# EAGLE schematic ALUDecoderMore1v2 (EAGLE 6.5.0)
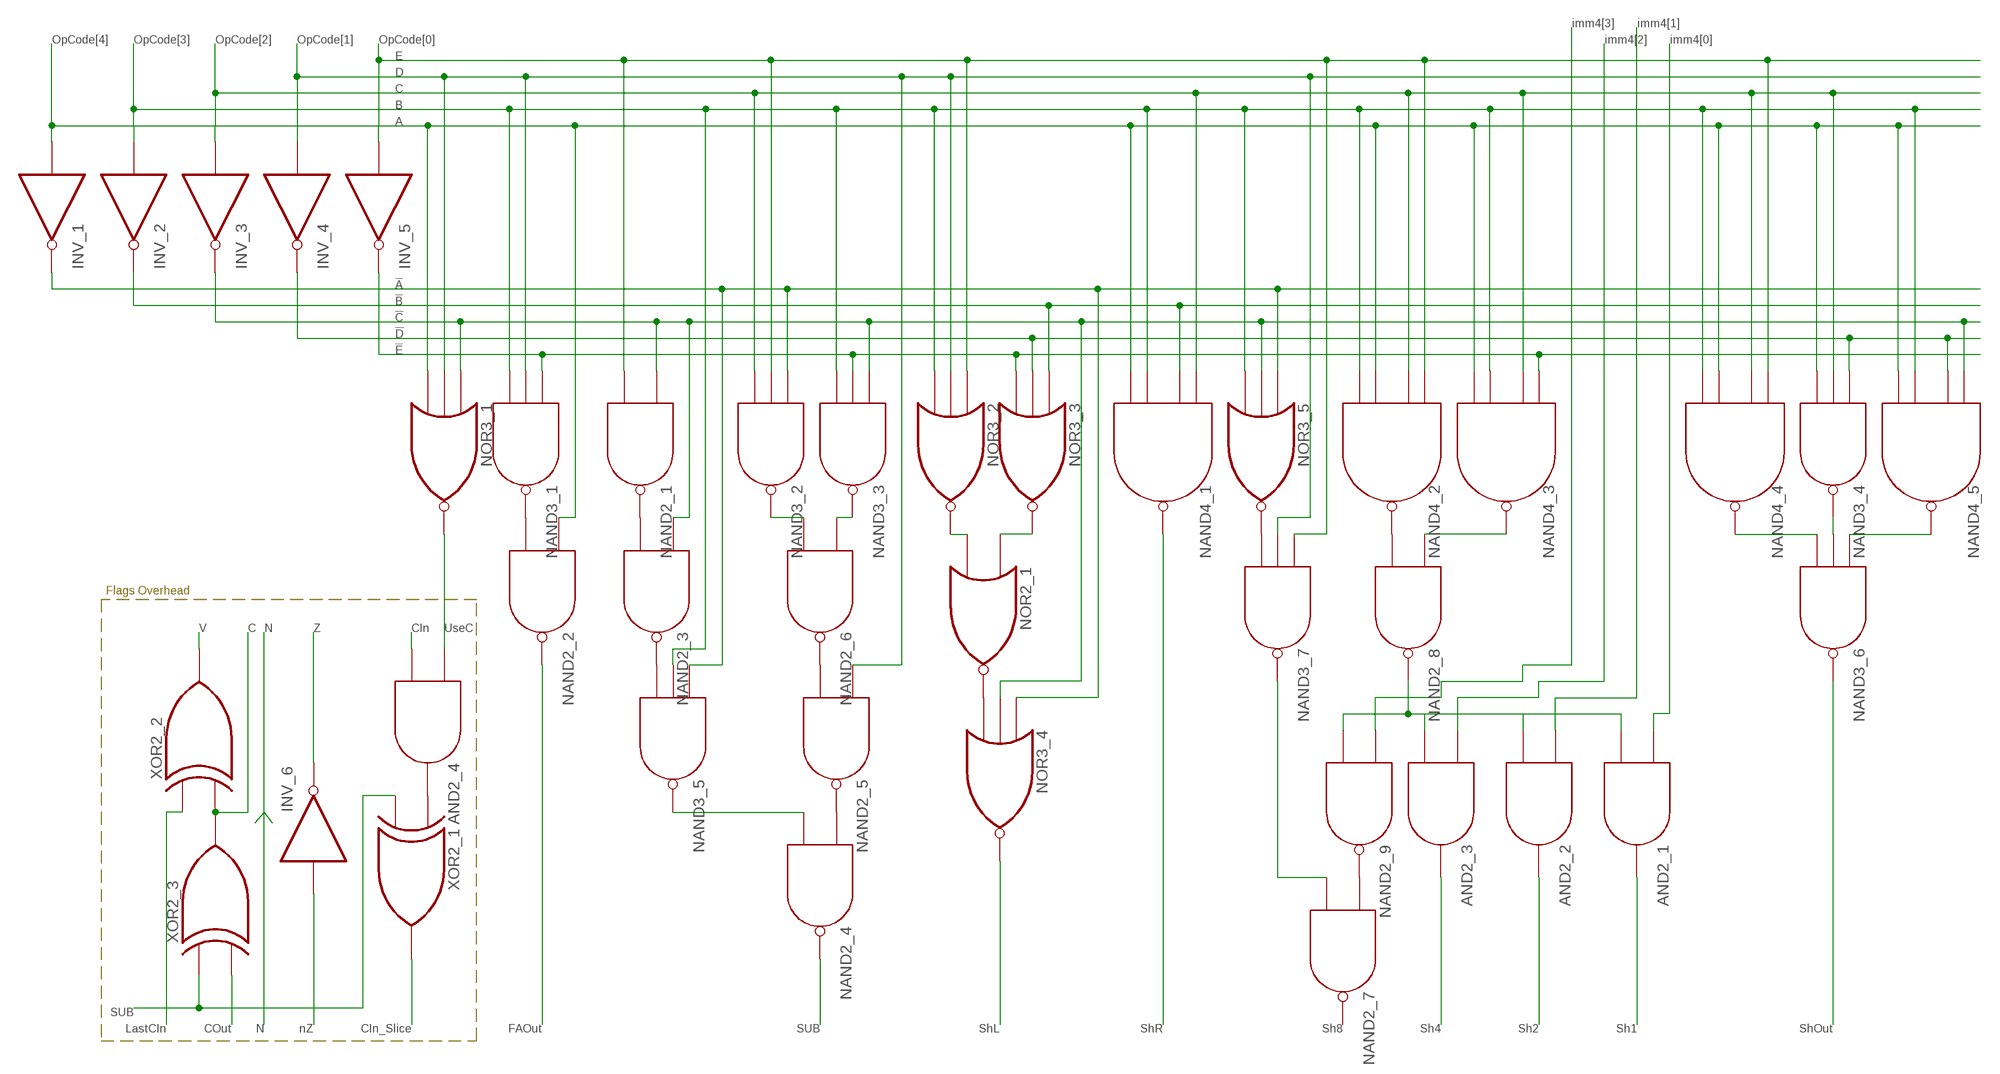
[diagram p0: schematic, sheet 1]

## Parts
AND2_1  AND2  [3PIN]
AND2_2  AND2  [3PIN]
AND2_3  AND2  [3PIN]
AND2_4  AND2  [3PIN]
INV_1  INV  [3PIN]
INV_2  INV  [3PIN]
INV_3  INV  [3PIN]
INV_4  INV  [3PIN]
INV_5  INV  [3PIN]
INV_6  INV  [3PIN]
NAND2_1  NAND2  [3PIN]
NAND2_2  NAND2  [3PIN]
NAND2_3  NAND2  [3PIN]
NAND2_4  NAND2  [3PIN]
NAND2_5  NAND2  [3PIN]
NAND2_6  NAND2  [3PIN]
NAND2_7  NAND2  [3PIN]
NAND2_8  NAND2  [3PIN]
NAND2_9  NAND2  [3PIN]
NAND3_1  NAND3  [5PIN]
NAND3_2  NAND3  [5PIN]
NAND3_3  NAND3  [5PIN]
NAND3_4  NAND3  [5PIN]
NAND3_5  NAND3  [5PIN]
NAND3_6  NAND3  [5PIN]
NAND3_7  NAND3  [5PIN]
NAND4_1  NAND4  [5PIN]
NAND4_2  NAND4  [5PIN]
NAND4_3  NAND4  [5PIN]
NAND4_4  NAND4  [5PIN]
NAND4_5  NAND4  [5PIN]
NOR2_1  NOR2  [3PIN]
NOR3_1  NOR3  [5PIN]
NOR3_2  NOR3  [5PIN]
NOR3_3  NOR3  [5PIN]
NOR3_4  NOR3  [5PIN]
NOR3_5  NOR3  [5PIN]
XOR2_1  XOR2  [3PIN]
XOR2_2  XOR2  [3PIN]
XOR2_3  XOR2  [3PIN]

## Nets
N$1: NAND2_1.P$3(O) NAND2_3.P$2(I1)
N$3: NAND2_2.P$2(I1) NAND3_1.P$4(O)
N$4: NAND2_3.P$3(O) NAND3_5.P$2(I1)
N$6: NAND2_6.P$2(I1) NAND3_2.P$4(O)
N$7: NAND2_2.P$3(O)
N$8: NAND2_6.P$1(A) NAND3_3.P$4(O)
N$9: NOR2_1.P$1(I0) NOR3_3.P$4(O)
N$10: NOR2_1.P$2(I1) NOR3_2.P$4(O)
N$11: NOR2_1.P$3(O) NOR3_4.P$2(I1)
N$12: NAND2_8.P$2(I1) NAND4_2.P$5(O)
N$13: NAND2_8.P$1(A) NAND4_3.P$5(O)
N$14: NAND2_4.P$1(A) NAND2_5.P$3(O)
N$15: NAND2_4.P$3(O)
N$16: AND2_1.P$2(I1) AND2_2.P$2(I1) AND2_3.P$2(I1) NAND2_8.P$3(O) NAND2_9.P$2(I1)
N$17: NAND3_6.P$2(I1) NAND4_4.P$5(O)
N$18: NAND3_4.P$4(O) NAND3_6.P$3(I2)
N$19: NOR3_4.P$4(O)
N$20: NAND3_6.P$1(A) NAND4_5.P$5(O)
N$22: NAND3_7.P$2(I1) NOR3_5.P$4(O)
N$23: XOR2_2.P$2(I1) XOR2_3.P$3(O)
N$24: NAND2_9.P$1(A)
N$25: XOR2_2.P$3(O)
N$27: NAND2_7.P$2(I1) NAND3_7.P$4(O)
N$28: AND2_3.P$1(A)
N$29: AND2_2.P$1(A)
N$30: AND2_1.P$1(A)
N$31: AND2_3.P$3(O)
N$32: AND2_2.P$3(O)
N$33: AND2_1.P$3(O)
N$35: INV_6.P$1(I)
N$36: XOR2_3.P$2(I1)
N$37: NAND3_6.P$4(O)
N$39: INV_6.P$2(O)
N$40: AND2_4.P$2(I1)
N$41: AND2_4.P$1(A) NOR3_1.P$4(O)
N$42: AND2_4.P$3(O) XOR2_1.P$1(I0)
N$43: XOR2_1.P$2(I1) XOR2_3.P$1(I0)
N$44: XOR2_1.P$3(O)
N$45: INV_2.P$1(I)
N$46: INV_3.P$1(I)
N$47: INV_4.P$1(I)
N$48: INV_5.P$1(I)
N$49: INV_3.P$2(O) INV_4.P$2(O) INV_5.P$2(O) NAND2_1.P$1(A) NAND2_3.P$1(A) NAND3_1.P$1(A) NAND3_3.P$1(A) NAND3_3.P$3(I2) NAND3_4.P$1(A) NAND4_3.P$1(A) NAND4_5.P$1(A) NAND4_5.P$2(A1) NOR3_1.P$1(I0) NOR3_3.P$2(I1) NOR3_3.P$3(I2) NOR3_4.P$3(I2) NOR3_5.P$3(I2)
N$50: NAND2_4.P$2(I1) NAND3_5.P$4(O)
N$51: NAND2_5.P$2(I1) NAND2_6.P$3(O)
N$52: NAND2_7.P$1(A) NAND2_9.P$3(O)
N$53: INV_1.P$2(O) NAND3_2.P$1(A) NAND3_5.P$1(A) NOR3_4.P$1(I0) NOR3_5.P$1(I0)
N$78: INV_2.P$2(O) NAND4_1.P$2(A1) NOR3_3.P$1(I0)
N$94: INV_1.P$1(I) NAND2_1.P$2(I1) NAND2_2.P$1(A) NAND2_5.P$1(A) NAND3_1.P$2(I1) NAND3_1.P$3(I2) NAND3_2.P$2(I1) NAND3_2.P$3(I2) NAND3_3.P$2(I1) NAND3_4.P$2(I1) NAND3_4.P$3(I2) NAND3_5.P$3(I2) NAND3_7.P$1(A) NAND3_7.P$3(I2) NAND4_1.P$3(I1) NAND4_1.P$4(I2) NAND4_2.P$1(A) NAND4_2.P$2(A1) NAND4_2.P$3(I1) NAND4_2.P$4(I2) NAND4_3.P$2(A1) NAND4_3.P$3(I1) NAND4_3.P$4(I2) NAND4_4.P$1(A) NAND4_4.P$2(A1) NAND4_4.P$3(I1) NAND4_4.P$4(I2) NAND4_5.P$3(I1) NAND4_5.P$4(I2) NOR3_1.P$2(I1) NOR3_1.P$3(I2) NOR3_2.P$1(I0) NOR3_2.P$2(I1) NOR3_2.P$3(I2) NOR3_5.P$2(I1)
Unconnected: NAND2_7.P$3(O) NAND4_1.P$1(A) NAND4_1.P$5(O) XOR2_2.P$1(I0)

## Notes on the sheet
- imm4[3] | imm4[1]
- OpCode[4] | OpCode[3] | OpCode[2] | OpCode[1] | OpCode[0] | imm4[2] | imm4[0]
- E
- D
- C
- B
- A
- !A
- !B
- !C
- !D
- !E
- Flags Overhead
- V | C | N | Z | CIn | UseC
- SUB
- LastCIn | COut | N | nZ | CIn_Slice | FAOut | SUB | ShL | ShR | Sh8 | Sh4 | Sh2 | Sh1 | ShOut

## Library data of the parts
AND2_1-AND2_4 = c035u:AND2
INV_1-INV_6 = c035u:INV
NAND2_1-NAND2_9 = c035u:NAND2
NAND3_1-NAND3_7 = c035u:NAND3
NAND4_1-NAND4_5 = c035u:NAND4
NOR2_1 = c035u:NOR2
NOR3_1-NOR3_5 = c035u:NOR3
XOR2_1-XOR2_3 = c035u:XOR2